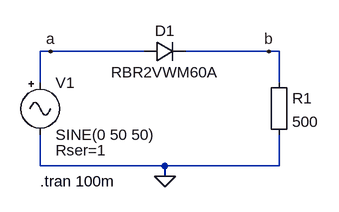
[diagram p0: schematic Diode-Rectifier-7.asc]
Diode-Rectifier-7.asc, the LTspice schematic file:
Version 4
SHEET 1 880 680
WIRE -256 144 -272 144
WIRE -112 144 -256 144
WIRE 80 144 -48 144
WIRE 96 144 80 144
WIRE -272 192 -272 144
WIRE 96 192 96 144
WIRE -272 320 -272 272
WIRE -80 320 -272 320
WIRE 96 320 96 272
WIRE 96 320 -80 320
WIRE -80 336 -80 320
FLAG -80 336 0
FLAG -256 144 a
FLAG 80 144 b
SYMBOL diode -112 160 R270
WINDOW 0 32 32 VTop 2
WINDOW 3 0 32 VBottom 2
SYMATTR InstName D1
SYMATTR Value RBR2VWM60A
SYMBOL Misc\\EuropeanResistor 80 176 R0
SYMATTR InstName R1
SYMATTR Value 500
SYMBOL Misc\\signal -272 176 R0
WINDOW 123 0 0 Left 2
WINDOW 39 24 120 Left 2
SYMATTR SpiceLine Rser=1
SYMATTR InstName V1
SYMATTR Value SINE(0 50 50)
TEXT -272 344 Left 2 !.tran 100m

The netlist it stands for:
* Diode-Rectifier-7.asc
D1 a b RBR2VWM60A
R1 b 0 500
V1 a 0 SINE(0 50 50) Rser=1
.model D D
.lib standard.dio
.tran 100m
.backanno
.end